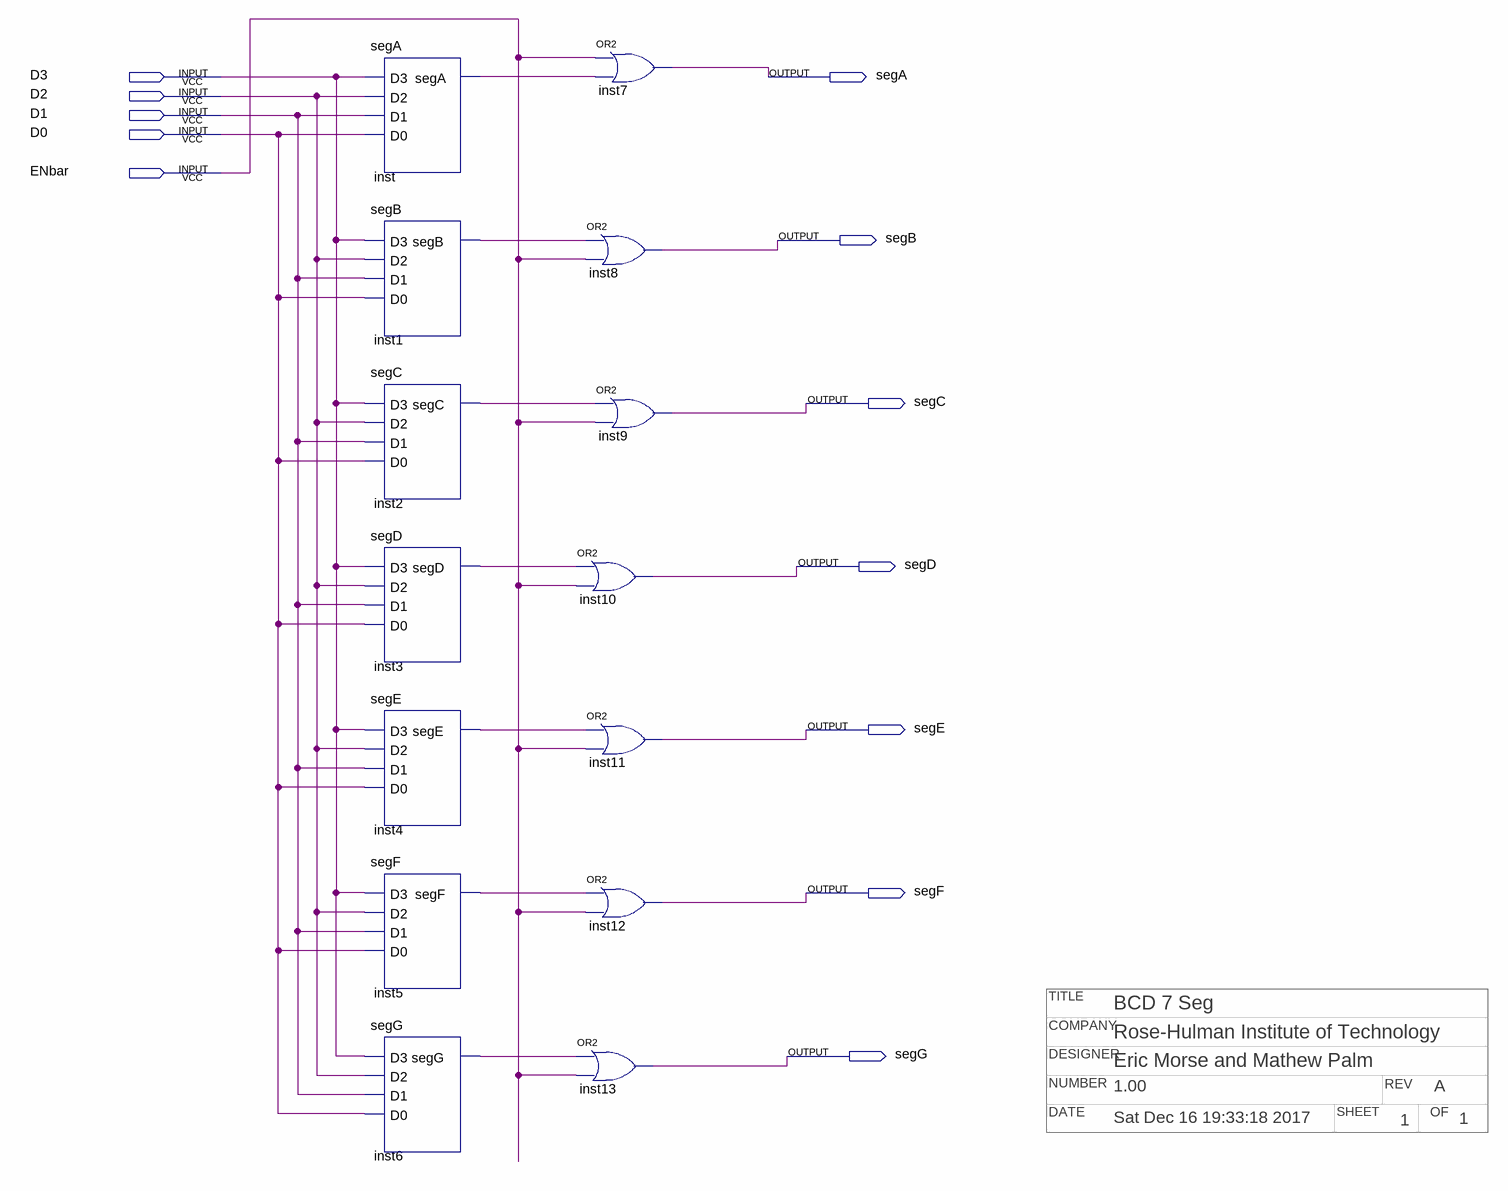
[diagram p0: schematic sheet]
// Quartus schematic bcd_7seg.bdf as structural Verilog: 14 symbols, 12 pins
// Title block: COMPANY: Rose-Hulman Institute of Technology; DATE: Sat Dec 16 19:33:18 2017; DESIGNER: Eric Morse and Mathew Palm; NUMBER: 1.00; OF: 1; REV: A; SHEET: 1; TITLE: BCD 7 Seg
module bcd_7seg (
  input  D3,
  input  D2,
  input  D1,
  input  D0,
  input  ENbar,
  output segA,
  output segB,
  output segC,
  output segD,
  output segE,
  output segF,
  output segG
);

  wire inst1_segb, inst2_segc, inst3_segd, inst4_sege, inst5_segf, inst6_segg, inst_sega;

  segA inst (.D3(D3), .D2(D2), .D1(D1), .D0(D0), .segA(inst_sega));
  segB inst1 (.D3(D3), .D2(D2), .D1(D1), .D0(D0), .segB(inst1_segb));
  segC inst2 (.D3(D3), .D2(D2), .D1(D1), .D0(D0), .segC(inst2_segc));
  segD inst3 (.D3(D3), .D2(D2), .D1(D1), .D0(D0), .segD(inst3_segd));
  segE inst4 (.D3(D3), .D2(D2), .D1(D1), .D0(D0), .segE(inst4_sege));
  segF inst5 (.D3(D3), .D2(D2), .D1(D1), .D0(D0), .segF(inst5_segf));
  segG inst6 (.D3(D3), .D2(D2), .D1(D1), .D0(D0), .segG(inst6_segg));
  or inst10 (segD, inst3_segd, ENbar);
  or inst13 (segG, inst6_segg, ENbar);
  or inst7 (segA, ENbar, inst_sega);
  or inst8 (segB, inst1_segb, ENbar);
  or inst9 (segC, inst2_segc, ENbar);
  or inst11 (segE, inst4_sege, ENbar);
  or inst12 (segF, inst5_segf, ENbar);
endmodule
